# Altium schematic sheet Differential Amplifier.schdoc: Differential Amplifier
size A4; Organization: Altium Limited; Address1: L3, 12a Rodborough Rd; Address2: Frenchs Forest; Address3: NSW; Address4: Australia 2086; DocumentNumber: 1; SheetNumber: 1; SheetTotal: 1
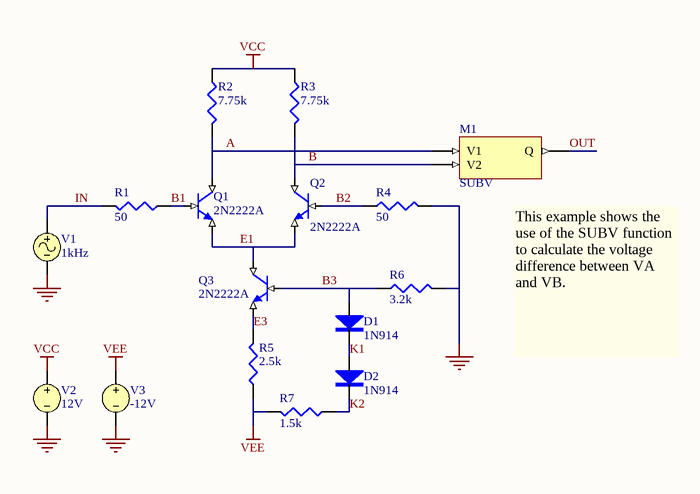
[diagram p0: Differential Amplifier.schdoc]

## Parts
D1  1N914
D2  1N914
M1  SUBV
Q1  2N2222A
Q2  2N2222A
Q3  2N2222A
R1  50
R2  7.75k
R3  7.75k
R4  50
R5  2.5k
R6  3.2k
R7  1.5k
V1  1kHz
V2  12V
V3  -12V

## Nets
GND: R4.1(TOP) R6.1(TOP) V1.2 V2.2 V3.2
VCC: R2.2(BOT) R3.2(BOT) V2.1
VEE: R5.2(BOT) R7.1(TOP) V3.1
A: M1.1(V1) Q1.1(C) R2.1(TOP)
B: M1.2(V2) Q2.1(C) R3.1(TOP)
B1: Q1.2(B) R1.2(BOT)
B2: Q2.2(B) R4.2(BOT)
B3: D1.1(A) Q3.2(B) R6.2(BOT)
E1: Q1.3(E) Q2.3(E) Q3.1(C)
E3: Q3.3(E) R5.1(TOP)
IN: R1.1(TOP) V1.1
K1: D1.2(K) D2.1(A)
K2: D2.2(K) R7.2(BOT)
OUT: M1.3(Q)

## Notes on the sheet
- (near M1) This example shows the use of the SUBV function to calculate the voltage difference between VA and VB.
- Title
- Size:
- Date:
- A4
- Number:
- Time:
- Revision:
- Sheet
- of
- File:

## Library data of the parts
D1 D2 = 1N914: Diode
M1 = SUBV: Subtract Voltages
Q1-Q3 = 2N2222A: NPN BJT
R1-R7 = RES: Resistor
  R1 R4: Value: 50
  R2 R3: Value: 7.75k
  R5: Value: 2.5k
  R6: Value: 3.2k
  R7: Value: 1.5k
V1 = VSIN: Sinusoidal Voltage Source
V2 V3 = VSRC: Voltage Source
  V2: Value: 12V
  V3: Value: -12V